# Altium project UF_Servo.PrjPcb (part 6 of 8)

## Sheet EEM_Connectors.SchDoc: EEM
size 420 x 297 mm; EDA_Number: ARTIQ; SPICEModelCacheVGBTAUBO: <root> / <DocumentId>VGBTAUBO</DocumentId> / <CacheFrame Number="0"> / <Model Name="pk14" Kind="CKT"> / <Text>*.INC dhvqfn.s / .SUBCKT pk14 / +    1   2   3   4   5   6   7   8   9  10 / +   11  12  13  14 / +   15  16  17  18  19  20  21  22  23  24 / +   25  26  27  28 / * Pin Resistance / r1 1 1001 9.078E-02 / r2 2 1002 8.829E-02 / r3 3 1003 8.731E-02 / r4 4 1004 8.710E-02 / r5 5 1005 8.731E-02 / r6 6 1006 8.829E-02 / r7 7 1007 9.075E-02 / r8 8 1008 9.072E-02 / r9 9 1009 8.809E-02 / r10 10 1010 8.716E-02 / r11 11 1011 8.706E-02 / r12 12 1012 8.720E-02 / r13 13 1013 8.816E-02 / r14 14 1014 9.068E-02 / * Pin Inductance / l1 1001 15 2.981E-09 / l2 1002 16 2.447E-09 / l3 1003 17 2.304E-09 / l4 1004 18 2.291E-09 / l5 1005 19 2.307E-09 / l6 1006 20 2.449E-09 / l7 1007 21 2.971E-09 / l8 1008 22 2.972E-09 / l9 1009 23 2.425E-09 / l10 1010 24 2.286E-09 / l11 1011 25 2.280E-09 / l12 1012 26 2.286E-09 / l13 1013 27 2.425E-09 / l14 1014 28 2.975E-09 / .ENDS pk14</Text> / </Model> / </CacheFrame> / </root>; CheckedBy: P.Kulik; Author: G.Kasprowicz; CompanyName: WUT ISE; DrawnBy: G.Kasprowicz; Organization: WUT ISE; Address1: PW ISE; Address2: Nowowiejska 15/19 00-665 Warsaw; Address3: gkasprow@gmail.com; Revision: 2; SheetNumber: 10; SheetTotal: 12; ModifiedBy: -; CheckedDate: -; Title2: Connectors; DivGrp: WUT ISE; Designer: G.Kasprowicz; ModifiedDate: -; ProjectName: Sensor Box
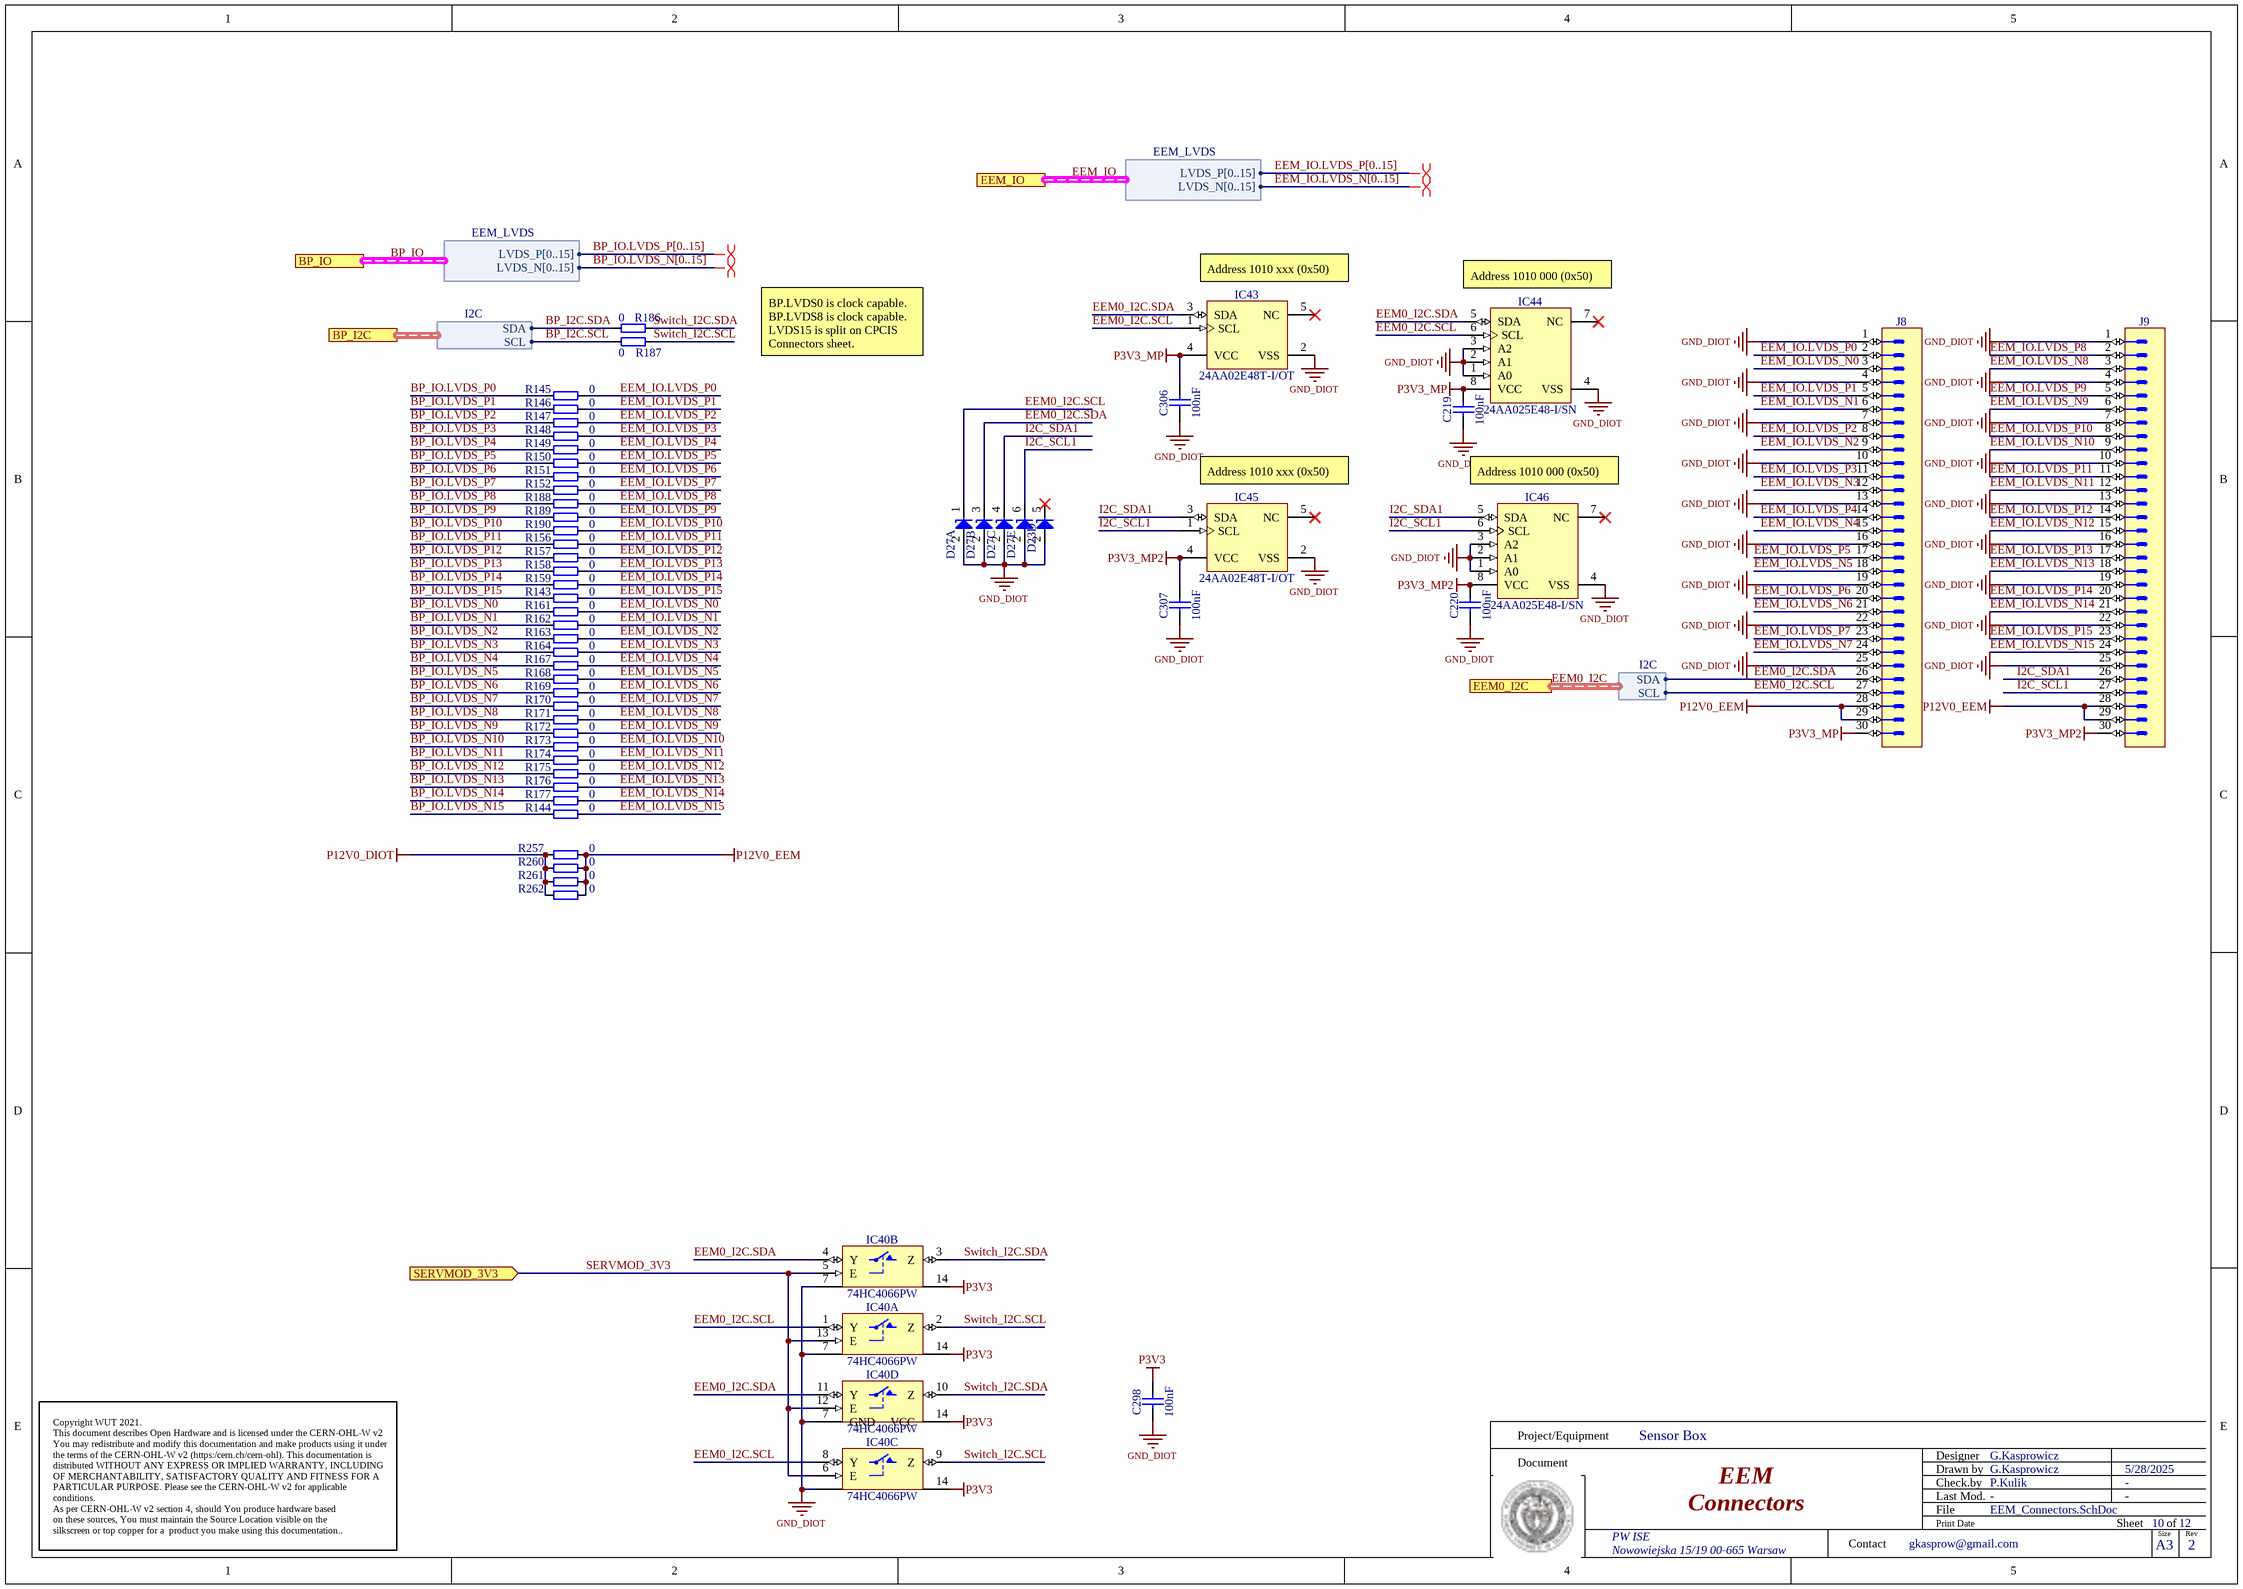
[diagram p9: EEM_Connectors.SchDoc]

### Parts
C219  100nF  [CAPC1005X55N]
C220  100nF  [CAPC1005X55N]
C298  100nF  [CAPC1005X55N]
C306  100nF  [CAPC1005X55N]
C307  100nF  [CAPC1005X55N]
D23  PESD3V3L5UY  [SOT65P210X110-6N]  (value not drawn)  (part D of 5)
D27  PESD3V3L5UY  [SOT65P210X110-6N]  (value not drawn)  (parts A,B,C,E of 5)
IC40  74HC4066PW  [SOP65P640X110-14N]  (parts A,B,C,D of 4)
IC43  24AA02E48T-I/OT  [SOT95P280X145-5N]
IC44  24AA025E48-I/SN  [SOIC127P600X175-8N]
IC45  24AA02E48T-I/OT  [SOT95P280X145-5N]
IC46  24AA025E48-I/SN  [SOIC127P600X175-8N]
J8  (no value)  [3M_N2530-6002RB]
J9  (no value)  [3M_N2530-6002RB]
R143  0  [RESC1005X40N]
R144  0  [RESC1005X40N]
R145  0  [RESC1005X40N]
R146  0  [RESC1005X40N]
R147  0  [RESC1005X40N]
R148  0  [RESC1005X40N]
R149  0  [RESC1005X40N]
R150  0  [RESC1005X40N]
R151  0  [RESC1005X40N]
R152  0  [RESC1005X40N]
R156  0  [RESC1005X40N]
R157  0  [RESC1005X40N]
R158  0  [RESC1005X40N]
R159  0  [RESC1005X40N]
R161  0  [RESC1005X40N]
R162  0  [RESC1005X40N]
R163  0  [RESC1005X40N]
R164  0  [RESC1005X40N]
R167  0  [RESC1005X40N]
R168  0  [RESC1005X40N]
R169  0  [RESC1005X40N]
R170  0  [RESC1005X40N]
R171  0  [RESC1005X40N]
R172  0  [RESC1005X40N]
R173  0  [RESC1005X40N]
R174  0  [RESC1005X40N]
R175  0  [RESC1005X40N]
R176  0  [RESC1005X40N]
R177  0  [RESC1005X40N]
R186  0  [RESC1005X40N]
R187  0  [RESC1005X40N]
R188  0  [RESC1005X40N]
R189  0  [RESC1005X40N]
R190  0  [RESC1005X40N]
R257  0  [RESC1005X40N]
R260  0  [RESC1005X40N]
R261  0  [RESC1005X40N]
R262  0  [RESC1005X40N]

### Ports
BP_I2C (harness I2C), BP_IO (harness EEM_LVDS), EEM0_I2C (harness I2C), EEM_IO (harness EEM_LVDS), SERVMOD_3V3 (in)

### Harnesses
I2C: SDA, SCL
EEM_LVDS: LVDS_P[0..15], LVDS_N[0..15]

### Nets
GND: C219.1 C220.1 C298.1 C306.1 C307.1 D23.2(A) D27.2(A) IC40.7(GND) IC43.2(VSS) IC44.1(A0) IC44.2(A1) IC44.3(A2) IC44.4(VSS) IC45.2(VSS) IC46.1(A0) IC46.2(A1) IC46.3(A2) IC46.4(VSS) J8.1 J8.4 J8.7 J8.10 J8.13 J8.16 J8.19 J8.22 J8.25 J9.1 J9.4 J9.7 J9.10 J9.13 J9.16 J9.19 J9.22 J9.25  [also labelled GND_DIOT]
P3V3: C298.2 IC40.14(VCC)
P3V3_MP: C219.2 C306.2 IC43.4(VCC) IC44.8(VCC) J8.30
P3V3_MP2: C220.2 C307.2 IC45.4(VCC) IC46.8(VCC) J9.30
P12V0_DIOT: R257.1 R260.1 R261.1 R262.1
P12V0_EEM: J8.28 J8.29 J9.28 J9.29 R257.2 R260.2 R261.2 R262.2
BP_I2C.SCL: R187.1 ; port BP_I2C.SCL
BP_I2C.SDA: R186.1 ; port BP_I2C.SDA
BP_IO.LVDS_N0: R161.1
BP_IO.LVDS_N1: R162.1
BP_IO.LVDS_N2: R163.1
BP_IO.LVDS_N3: R164.1
BP_IO.LVDS_N4: R167.1
BP_IO.LVDS_N5: R168.1
BP_IO.LVDS_N6: R169.1
BP_IO.LVDS_N7: R170.1
BP_IO.LVDS_N8: R171.1
BP_IO.LVDS_N9: R172.1
BP_IO.LVDS_N10: R173.1
BP_IO.LVDS_N11: R174.1
BP_IO.LVDS_N12: R175.1
BP_IO.LVDS_N13: R176.1
BP_IO.LVDS_N14: R177.1
BP_IO.LVDS_N15: R144.2
BP_IO.LVDS_P0: R145.1
BP_IO.LVDS_P1: R146.1
BP_IO.LVDS_P2: R147.1
BP_IO.LVDS_P3: R148.1
BP_IO.LVDS_P4: R149.1
BP_IO.LVDS_P5: R150.1
BP_IO.LVDS_P6: R151.1
BP_IO.LVDS_P7: R152.1
BP_IO.LVDS_P8: R188.1
BP_IO.LVDS_P9: R189.1
BP_IO.LVDS_P10: R190.1
BP_IO.LVDS_P11: R156.1
BP_IO.LVDS_P12: R157.1
BP_IO.LVDS_P13: R158.1
BP_IO.LVDS_P14: R159.1
BP_IO.LVDS_P15: R143.2
EEM0_I2C.SCL: D27.1(C) IC40.1(Y) IC40.8(Y) IC43.1(SCL) IC44.6(SCL) J8.27 ; port EEM0_I2C.SCL
EEM0_I2C.SDA: D27.3(C) IC40.4(Y) IC40.11(Y) IC43.3(SDA) IC44.5(SDA) J8.26 ; port EEM0_I2C.SDA
EEM_IO.LVDS_N0: J8.3 R161.2
EEM_IO.LVDS_N1: J8.6 R162.2
EEM_IO.LVDS_N2: J8.9 R163.2
EEM_IO.LVDS_N3: J8.12 R164.2
EEM_IO.LVDS_N4: J8.15 R167.2
EEM_IO.LVDS_N5: J8.18 R168.2
EEM_IO.LVDS_N6: J8.21 R169.2
EEM_IO.LVDS_N7: J8.24 R170.2
EEM_IO.LVDS_N8: J9.3 R171.2
EEM_IO.LVDS_N9: J9.6 R172.2
EEM_IO.LVDS_N10: J9.9 R173.2
EEM_IO.LVDS_N11: J9.12 R174.2
EEM_IO.LVDS_N12: J9.15 R175.2
EEM_IO.LVDS_N13: J9.18 R176.2
EEM_IO.LVDS_N14: J9.21 R177.2
EEM_IO.LVDS_N15: J9.24 R144.1
EEM_IO.LVDS_P0: J8.2 R145.2
EEM_IO.LVDS_P1: J8.5 R146.2
EEM_IO.LVDS_P2: J8.8 R147.2
EEM_IO.LVDS_P3: J8.11 R148.2
EEM_IO.LVDS_P4: J8.14 R149.2
EEM_IO.LVDS_P5: J8.17 R150.2
EEM_IO.LVDS_P6: J8.20 R151.2
EEM_IO.LVDS_P7: J8.23 R152.2
EEM_IO.LVDS_P8: J9.2 R188.2
EEM_IO.LVDS_P9: J9.5 R189.2
EEM_IO.LVDS_P10: J9.8 R190.2
EEM_IO.LVDS_P11: J9.11 R156.2
EEM_IO.LVDS_P12: J9.14 R157.2
EEM_IO.LVDS_P13: J9.17 R158.2
EEM_IO.LVDS_P14: J9.20 R159.2
EEM_IO.LVDS_P15: J9.23 R143.1
I2C_SCL1: D27.6(C) IC45.1(SCL) IC46.6(SCL) J9.27
I2C_SDA1: D27.4(C) IC45.3(SDA) IC46.5(SDA) J9.26
SERVMOD_3V3: IC40.5(E) IC40.6(E) IC40.12(E) IC40.13(E) ; port SERVMOD_3V3
Switch_I2C.SCL: IC40.2(Z) IC40.9(Z) R187.2
Switch_I2C.SDA: IC40.3(Z) IC40.10(Z) R186.2

Not connected (* = marked no-connect by the designer): D23 5(C)*; IC43 5(NC)*; IC44 7(NC)*; IC45 5(NC)*; IC46 7(NC)*

### Buses and harness runs
bus BP_IO.LVDS_N[0..15]
bus BP_IO.LVDS_P[0..15]
bus EEM_IO.LVDS_N[0..15]
bus EEM_IO.LVDS_P[0..15]
harness BP_IO = port BP_IO
harness EEM0_I2C = port EEM0_I2C
harness EEM_IO = port EEM_IO

### Layout directives
differential pair; net class D100: (no net found under the mark)

### Notes on the sheet
- (near IC43) Address 1010 xxx (0x50)
- (near IC44) Address 1010 000 (0x50)
- BP.LVDS0 is clock capable.
  BP.LVDS8 is clock capable.
  LVDS15 is split on CPCIS Connectors sheet.
- Address 1010 xxx (0x50)
- Address 1010 000 (0x50)
- Project/Equipment
- Document
- Designer
- Drawn by
- Check.by
- Contact
- File
- Last Mod.
- Print Date
- Sheet
- Size
- A3
- of
- Rev
- Copyright WUT 2021.
  This document describes Open Hardware and is licensed under the CERN-OHL-W v2
  You may redistribute and modify this documentation and make products using it under the terms of the CERN-OHL-W v2 (https:/cern.ch/cern-ohl). This documentation is distributed WITHOUT ANY EXPRESS OR IMPLIED WARRANTY, INCLUDING OF MERCHANTABILITY, SATISFACTORY QUALITY AND FITNESS FOR A PARTICULAR PURPOSE. Please see the CERN-OHL-W v2 for applicable conditions.
  As per CERN-OHL-W v2 section 4, should You produce hardware based
  on these sources, You must maintain the Source Location visible on the
  silkscreen or top copper for a  product you make using this documentation..

### Library data of the parts
C219 C220 C298 C306 C307 = CC0402_100NF_50V_10%_X7R: as C184-C188 on sheet IO_Expander; Part Number: CC0402_100NF_50V_10%_X7R; Component Kind: Standard; Component Type: Standard; Pin Count: 2; Value: 100nF; Status: None; Manufacturer Part Number: CC0402_100NF_50V_10%_X7R; Case: 0402; Mounted: Yes; Socket: No; SMD: Yes; Sense: No; HelpURL: \\cern.ch\dfs\Applications\Altium\Datasheets\CC0402_MURATA_GRM155R71H104KE14D.pdf; Author: CERN DEM MR; CreateDate: 30.06.2017; LatestRevisionDate: 30.06.2017; Manufacturer1 Example: MURATA; Manufacturer1 ComponentHeight: 0.55mm
D23 D27 = PESD3V3L5UY: Fivefold ESD Protection Diode Arrays; Part Description: Fivefold ESD Protection Diode Arrays (30kV); Manufacturer: NEXPERIA; Voltage: 3.3V; Power: 200W; PressFit: No; Bonding: No; Part Number: PESD3V3L5UY; Component Kind: Standard; Component Type: Standard; Device: PESD3V3L5UY; PackageDescription: SOT363, SC-88, 0.65mm Pitch; 6 Pin, 1.25mm W X 2.00mm L X 1.10mm H body, IPC Medium Density; Manufacturer Part Number: PESD3V3L5UY; Pin Count: 6; Case: SOT363; Mounted: Yes; Socket: No; SMD: Yes; Sense: No; ComponentHeight: 1.1mm; HelpURL: \\cern.ch\dfs\Applications\Altium\Datasheets\PESD3V3L5UY.pdf; Author: CERN DEM WB; CreateDate: 05.07.2021; LatestRevisionDate: 05.07.2021
IC40 = 74HC4066PW: Part Description: Quad Single-Pole Single-Throw Analog Switch; Manufacturer: NXP SEMICONDUCTORS; PressFit: No; Bonding: No; Table: Standard Logic; Part Number: 74HC4066PW; Component Kind: Standard; Component Type: Standard; Device: 74HC4066PW; PackageDescription: SOP, 14-Leads, Body 4.4x5mm (max), Pitch 0.65mm, IPC Medium Density; Manufacturer Part Number: 74HC4066PW; Pin Count: 14; Case: TSSOP14; Mounted: Yes; Socket: No; SMD: Yes; ComponentHeight: 1.1mm; Author: CERN DEM JLC; HelpURL: \\cern.ch\dfs\Applications\Altium\Datasheets\74HC4066PW.pdf; CreateDate: 2014-11-19; LatestRevisionDate: 2014-11-19
IC43 IC45 = 24AA02E48T-I/OT: 1.7V-5.5V, 2K I2C Serial EEPROM With EUI-48 Node Identity; Manufacturer: MICROCHIP TECHNOLOGY; PressFit: No; Bonding: No; Part Number: 24AA02E48T-I/OT; Component Kind: Standard; Component Type: Standard; Device: 24AA02E48T-I/OT; PackageDescription: SOT, 0.95mm pitch; 5 pin, 1.60mm W X 2.90mm L X 1.45mm H body, IPC Medium Density; Part Description: 1.7V-5.5V, 2K I2C Serial EEPROM with EUI-48 Node Identity; Manufacturer Part Number: 24AA02E48T-I/OT; Pin Count: 5; Case: SOT23-5; Mounted: Yes; Socket: No; SMD: Yes; Sense: No; ComponentHeight: 1.45mm; HelpURL: \\cern.ch\dfs\Applications\Altium\Datasheets\24AA02E48T-I-OT.pdf; Author: CERN DEM MR; CreateDate: 31.03.2016; LatestRevisionDate: 31.03.2016
IC44 IC46 = 24AA025E48-I/SN: 1.7V-5.5V, 2K I2C™ Serial EEPROMs with EUI-48™ Node Identity; Manufacturer: MICROCHIP TECHNOLOGY; PressFit: No; Bonding: No; Part Number: 24AA025E48-I/SN; Component Kind: Standard; Component Type: Standard; Device: 24AA025E48-I/SN; PackageDescription: SOIC 8, Pitch 1.27mm - Body 4x5mm, IPC Medium Density; Part Description: 1.7V-5.5V, 2K I2C™ Serial EEPROMs with EUI-48™ Node Identity; Manufacturer Part Number: 24AA025E48-I/SN; Pin Count: 8; Case: SOIC8; Mounted: Yes; Socket: No; SMD: Yes; Sense: No; ComponentHeight: 1.75mm; HelpURL: \\cern.ch\dfs\Applications\Altium\Datasheets\24AA025E48-I-SN.pdf; Author: CERN DEM MR; CreateDate: 19.07.2016; LatestRevisionDate: 19.07.2016
J8 J9 = 3M_N2530-6002RB: Connector 30 Male; Part Description: 30 Contacts - Straight .100'' x .100'' Low Profile Four-Wall Header, 2500 Series; Manufacturer: 3M; PressFit: No; Part Number: 3M_N2530-6002RB; Component Kind: Standard; Component Type: Standard; Pin Count: 30; Family: Header 30; Mounted: Yes; Socket: No; SMD: No; Sense: No; Status: None; Manufacturer Part Number: N2530-6002RB; ComponentHeight: 10.03mm; HelpURL: \\cern.ch\dfs\Applications\Altium\Datasheets\3M_N2530-6002RB.pdf; Author: CERN DEM JLC; CreateDate: 11.02.2009; LatestRevisionDate: 11.08.2009
R143-R152 R156-R159 R161-R164 R167-R177 R186-R190 R257 R260-R262 = R0402_0R_JUMPER: Resistor; Part Description: 1A (0.05R Max DC Resistance) Zero Ohm Jumper; Manufacturer: GENERIC; Manufacturer1 Part Number: 232270591001L; PressFit: No; Part Number: R0402_0R_JUMPER; Component Kind: Standard; Component Type: Standard; Pin Count: 2; Value: 0; Status: Not Recommended; Manufacturer Part Number: R0402_0R_JUMPER; Case: 0402; Mounted: Yes; Sense: No; Socket: No; SMD: Yes; Manufacturer1 Example: YAGEO PHYCOMP; Manufacturer1 ComponentHeight: 0.4mm; HelpURL: \\cern.ch\dfs\Applications\Altium\Datasheets\R0402_Phycomp_RC0402.pdf; Author: CERN DEM JLC; CreateDate: 03.12.2007; LatestRevisionDate: 17.10.2012

## Sheet Isolated_Power_supply.SchDoc: Power Supply
size A2; Author: M.Beldyga; CompanyName: WUT ISE; DrawnBy: M.Beldyga; Organization: WUT ISE; Address1: PW ISE; Address2: Nowowiejska 15/19 00-665 Warsaw; Address3: micbeldyga@gmail.com; SheetNumber: 11; SheetTotal: 12; ModifiedBy: -; CheckedDate: -; Title2: LLC + LDO; DivGrp: WUT ISE; Designer: M.Beldyga; ModifiedDate: -; ProjectName: Sensor Box
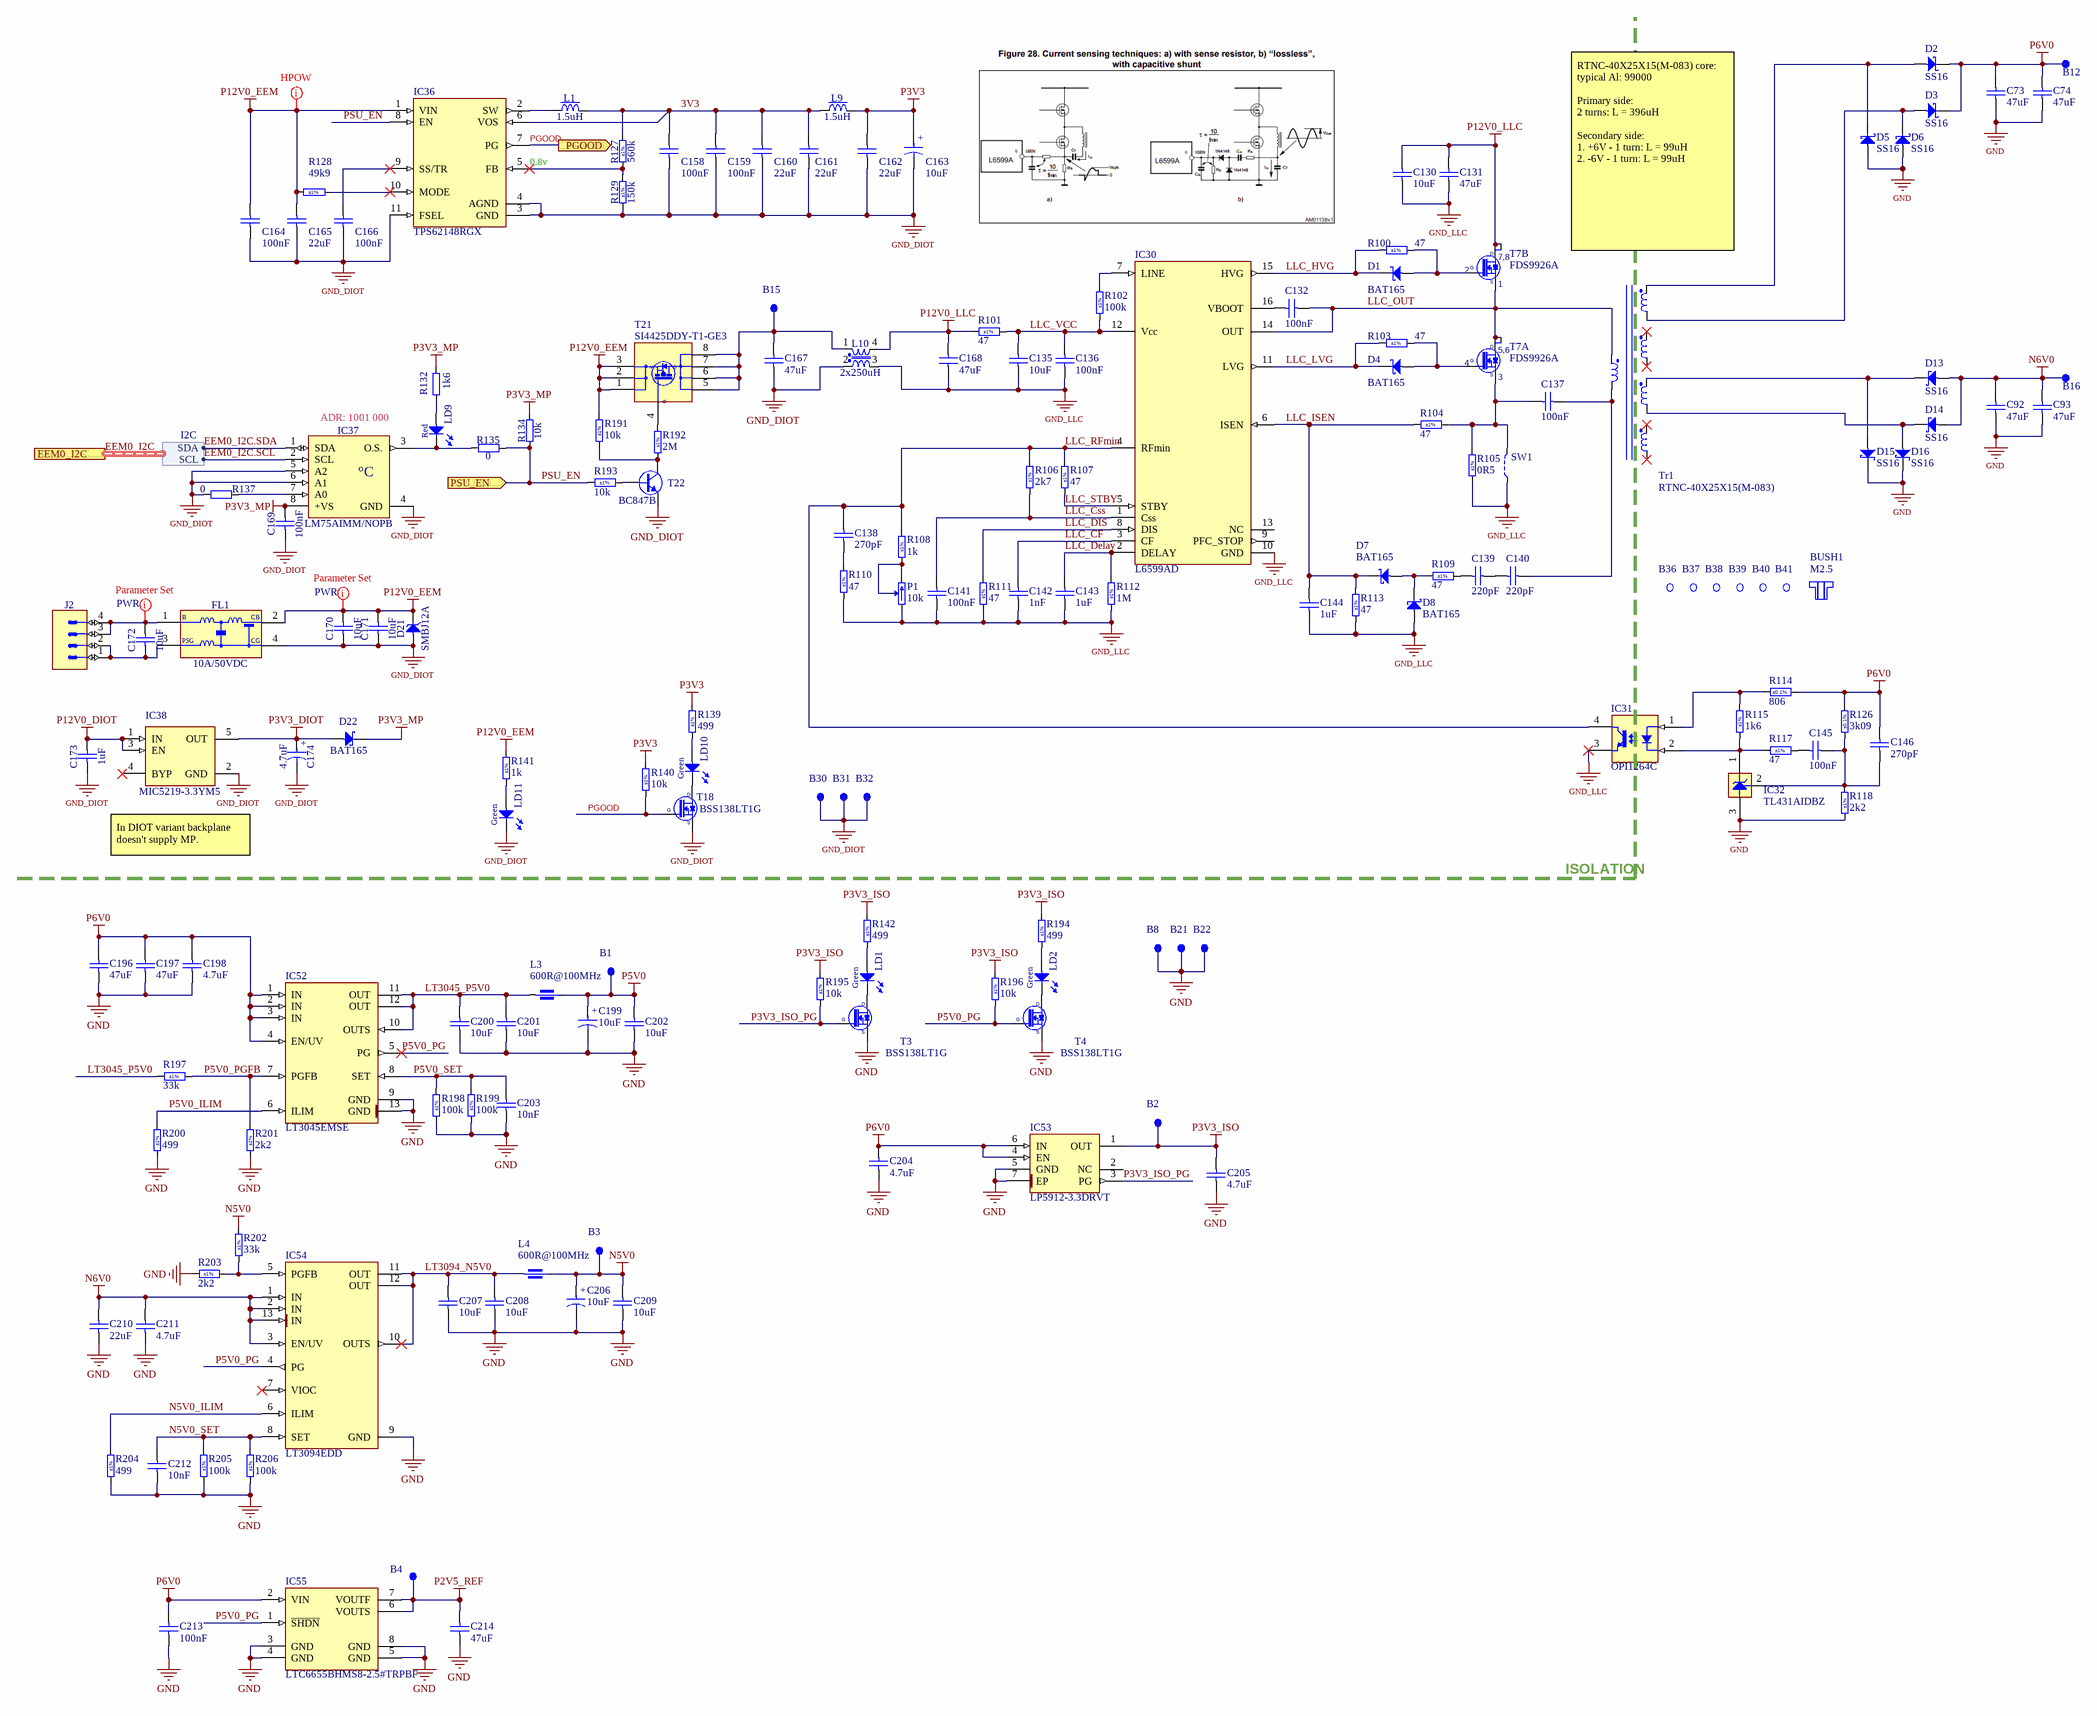
[diagram p10: Isolated_Power_supply.SchDoc]

### Parts
(Parts that share a designator on the sheet are numbered #1, #2 ... from top to bottom, then left to right.)
B1  SMD Pad  [C100]  (value not drawn)  (no BOM)
B2  SMD Pad  [C100]  (value not drawn)  (no BOM)
B3  SMD Pad  [C100]  (value not drawn)  (no BOM)
B4  SMD Pad  [C100]  (value not drawn)  (no BOM)
B8  SMD Pad  [C100]  (value not drawn)  (no BOM)
B12  SMD Pad  [C100]  (value not drawn)  (no BOM)
B15  SMD Pad  [C100]  (value not drawn)  (no BOM)
B16  SMD Pad  [C100]  (value not drawn)  (no BOM)
B21  SMD Pad  [C100]  (value not drawn)  (no BOM)
B22  SMD Pad  [C100]  (value not drawn)  (no BOM)
B30  SMD Pad  [C100]  (value not drawn)  (no BOM)
B31  SMD Pad  [C100]  (value not drawn)  (no BOM)
B32  SMD Pad  [C100]  (value not drawn)  (no BOM)
B36  Non Plated Hole  [MTG300]  (value not drawn)  (no BOM)
B37  Non Plated Hole  [MTG300]  (value not drawn)  (no BOM)
B38  Non Plated Hole  [MTG300]  (value not drawn)  (no BOM)
B39  Non Plated Hole  [MTG300]  (value not drawn)  (no BOM)
B40  Non Plated Hole  [MTG300]  (value not drawn)  (no BOM)
B41  Non Plated Hole  [MTG300]  (value not drawn)  (no BOM)
BUSH1  M2.5  [WURTH_9774010151]
C73  47uF  [CAPC3216X180N]
C74  47uF  [CAPC3216X180N]
C92  47uF  [CAPC3216X180N]
C93  47uF  [CAPC3216X180N]
C130  10uF  [CAPC3216X180N]
C131  47uF  [CAPC3216X180N]
C132  100nF  [CAPC1005X55N]
C135  10uF  [CAPC3216X180N]
C136  100nF  [CAPC1005X55N]
C137  100nF  [CAPC4532X250N]
C138  270pF  [CAPC1608X87N]
C139  220pF  [CAPC3225X200N]
C140  220pF  [CAPC3225X200N]
C141  100nF  [CAPC1005X55N]
C142  1nF  [CAPC1608X90N]
C143  1uF  [CAPC1608X87N]
C144  1uF  [CAPC1608X87N]
C145  100nF  [CAPC1005X55N]
C146  270pF  [CAPC1608X87N]
C158  100nF  [CAPC1005X55N]
C159  100nF  [CAPC1005X55N]
C160  22uF  [CAPC2012X135N]
C161  22uF  [CAPC2012X135N]
C162  22uF  [CAPC2012X135N]
C163  10uF  [CAPMP3216X180N]
C164  100nF  [CAPC1005X55N]
C165  22uF  [CAPC2012X135N]
C166  100nF  [CAPC1005X55N]
C167  47uF  [CAPC3216X180N]
C168  47uF  [CAPC3216X180N]
C169  100nF  [CAPC1005X55N]
C170  10uF  [CAPC2012X95N]
C171  10uF  [CAPC2012X95N]
C172  10uF  [CAPC2012X95N]
C173  1uF  [CAPC1608X87N]
C174  4.7uF  [CAPMP3216X180N]
C196  47uF  [CAPC3216X180N]
C197  47uF  [CAPC3216X180N]
C198  4.7uF  [CAPC1608X90N]
C199  10uF  [CAPMP3216X180N]
C200  10uF  [CAPC2012X95N]
C201  10uF  [CAPC2012X95N]
C202  10uF  [CAPC2012X95N]
C203  10nF  [CAPC1005X55N]
C204  4.7uF  [CAPC1608X90N]
C205  4.7uF  [CAPC1608X90N]
C206  10uF  [CAPMP3216X180N]
C207  10uF  [CAPC2012X95N]
C208  10uF  [CAPC2012X95N]
C209  10uF  [CAPC2012X95N]
C210  22uF  [CAPC2012X135N]
C211  4.7uF  [CAPC1608X90N]
C212  10nF  [CAPC1005X55N]
C213  100nF  [CAPC1005X55N]
C214  47uF  [CAPC2012X140N]
D1  BAT165  [SOD2512X110N]
D2  SS16  [DIOM5127X229N]
D3  SS16  [DIOM5127X229N]
D4  BAT165  [SOD2512X110N]
D5#2  SS16  [DIOM5127X229N]
D6#2  SS16  [DIOM5127X229N]
D7#2  BAT165  [SOD2512X110N]
D8  BAT165  [SOD2512X110N]
D13  SS16  [DIOM5127X229N]
D14  SS16  [DIOM5127X229N]
D15  SS16  [DIOM5127X229N]
D16  SS16  [DIOM5127X229N]
D21  SMBJ12A  [DIOM5336X265N]
D22  BAT165  [SOD2512X110N]
FL1  10A/50VDC  [FIL_MURATA_BNX02]
IC30  L6599AD  [SOP127P600X175-16N]
IC31  OPI1264C  [OPI1264C]
IC32  TL431AIDBZ  [SOT95P237X112-3N]
IC36  TPS62148RGX  [TEXAS_RGX0011A]
IC37  LM75AIMM/NOPB  [SOP65P490X109-8N]
IC38  MIC5219-3.3YM5  [SOT95P280X145-5N]
IC52  LT3045EMSE  [SOP65P490X110-13N-R175X294]
IC53  LP5912-3.3DRVT  [SON65P200X200X80-7N-R110X170]
IC54  LT3094EDD  [SON45P300X300X80-13N-R175X248]
IC55  LTC6655BHMS8-2.5#TRPBF  [SOP65P490X110-8N]
J2  Mini-Fit Jr.™  [MOLEX_39-30-0040]  (value not drawn)
L1  1.5uH  [IND_WURTH_WE-LHMI_7050]
L3  600R@100MHz  [INDC1608X95N]
L4  600R@100MHz  [INDC1608X95N]
L9  1.5uH  [IND_WURTH_WE-LHMI_7050]
L10  2x250uH  [IND_WURTH_WE-SL2]
LD1  Green  [LED_KINGBRIGHT_KP-1608CGCK]
LD2  Green  [LED_KINGBRIGHT_KP-1608CGCK]
LD9  Red  [LED_AVAGO_HSMC-C110]
LD10  Green  [LED_KINGBRIGHT_KP-1608CGCK]
LD11  Green  [LED_AVAGO_HSME-C110]
P1  10k  [TRIM_BOURNS_3314G-1]
R100  47  Tolerance: ±1%  [RESC1608X55N]
R101  47  Tolerance: ±1%  [RESC1608X55N]
R102  100k  Tolerance: ±1%  [RESC1005X40N]
R103  47  Tolerance: ±1%  [RESC1608X55N]
R104  47  Tolerance: ±1%  [RESC1608X55N]
R105  0R5  Tolerance: ±1%  [RESC6532X80N]
R106  2k7  Tolerance: ±1%  [RESC1608X55N]
R107  47  Tolerance: ±1%  [RESC1608X55N]
R108  1k  Tolerance: ±1%  [RESC1005X40N]
R109  47  Tolerance: ±1%  [RESC1608X55N]
R110  47  Tolerance: ±1%  [RESC1608X55N]
R111  47  Tolerance: ±1%  [RESC1608X55N]
R112  1M  Tolerance: ±1%  [RESC1608X55N]
R113  47  Tolerance: ±1%  [RESC1608X55N]
R114  806  Tolerance: ±0.1%  [RESC1608X55N]
R115  1k6  Tolerance: ±1%  [RESC1608X55N]
R117  47  Tolerance: ±1%  [RESC1608X55N]
R118  2k2  Tolerance: ±1%  [RESC1005X40N]
R126  3k09  Tolerance: ±0.1%  [RESC1608X55N]
R127  560k  Tolerance: ±1%  [RESC1608X55N]
R128  49k9  Tolerance: ±1%  [RESC1608X55N]
R129  150k  Tolerance: ±1%  [RESC1608X55N]
R132#2  1k6  [RESC1005X40N]
R134#2  10k  [RESC1608X55N]
R135#2  0  [RESC1005X40N]
R137#2  0  [RESC1005X40N]
R139#2  499  Tolerance: ±1%  [RESC1005X40N]
R140#2  10k  Tolerance: ±1%  [RESC1005X40N]
R141  1k  Tolerance: ±1%  [RESC1005X40N]
R142  499  Tolerance: ±1%  [RESC1005X40N]
R191  10k  Tolerance: ±1%  [RESC1005X40N]
R192  2M  Tolerance: ±1%  [RESC1005X40N]
R193  10k  Tolerance: ±1%  [RESC1005X40N]
R194  499  Tolerance: ±1%  [RESC1005X40N]
R195  10k  Tolerance: ±1%  [RESC1005X40N]
R196  10k  Tolerance: ±1%  [RESC1005X40N]
R197  33k  Tolerance: ±1%  [RESC1005X40N]
R198  100k  Tolerance: ±1%  [RESC1005X40N]
R199  100k  Tolerance: ±1%  [RESC1005X40N]
R200  499  Tolerance: ±1%  [RESC1005X40N]
R201  2k2  Tolerance: ±1%  [RESC1005X40N]
R202  33k  Tolerance: ±1%  [RESC1005X40N]
R203  2k2  Tolerance: ±1%  [RESC1005X40N]
R204  499  Tolerance: ±1%  [RESC1005X40N]
R205  100k  Tolerance: ±1%  [RESC1005X40N]
R206  100k  Tolerance: ±1%  [RESC1005X40N]
SW1  Switch  [JUMPSMD0805_G50]  (value not drawn)  (no BOM)
T3  BSS138LT1G  [SOT95P240X110-3N]
T4  BSS138LT1G  [SOT95P240X110-3N]
T7  FDS9926A  [SOIC127P600X175-8N]  (parts A,B of 2)
T18  BSS138LT1G  [SOT95P240X110-3N]
T21  SI4425DDY-T1-GE3  [SOIC127P600X175-8N]
T22  BC847B  [SOT95P230X110-3N]
Tr1  RTNC-40X25X15(M-083)  [RTNC-40X25X15(M-083)]

### Ports
EEM0_I2C (harness I2C), PGOOD (out), PSU_EN (in)

### Harnesses
I2C: SDA, SCL

### Nets
GND: B8.1 B21.1 B22.1 B30.1 B31.1 B32.1 C73.2 C74.2 C92.2 C93.2 C158.1 C159.1 C160.1 C161.1 C162.1 C163.2 C164.1 C165.1 C166.1 C167.1 C169.1 C170.1 C171.1 C173.1 C174.2 C196.1 C197.1 C198.1 C199.2 C200.1 C201.1 C202.1 C203.1 C204.1 C205.1 C206.2 C207.1 C208.1 C209.1 C210.1 C211.1 C212.1 C213.1 C214.1 D5#2.2(A) D6#2.2(A) D15.1(C) D16.1(C) D21.2(A) FL1.4(CG) IC32.3(A) IC36.3(GND) IC36.4(AGND) IC36.11(FSEL) IC37.4(GND) IC37.5(A2) IC37.6(A1) IC38.2(GND) IC52.9(GND) IC52.13(GND) IC53.5(GND) IC53.7(EP) IC54.9(GND) IC55.3(GND) IC55.4(GND) IC55.5(GND) IC55.8(GND) L10.2 LD11.1(C) R118.1 R129.1 R137#2.1 R198.1 R199.1 R200.1 R201.1 R203.2 R204.1 R205.1 R206.1 T3.2(S) T4.2(S) T18.2(S) T22.2(E)  [also labelled GND_DIOT]
GND_LLC: C130.2 C131.2 C135.2 C136.1 C141.2 C142.1 C143.1 C144.1 C168.1 D8.2(A) IC30.10(GND) IC31.3(E) L10.3 P1.1(CCW) R105.1 R110.1 R111.1 R112.1 R113.1 SW1.1
N5V0: B3.1 C206.1 C209.2 L4.2 R202.2
N6V0: B16.1 C92.1 C93.1 C210.2 C211.2 D13.2(A) D14.2(A) IC54.1(IN) IC54.2(IN) IC54.3(EN/UV) IC54.13(IN)
P2V5_REF: B4.1 C214.2 IC55.6(VOUTS) IC55.7(VOUTF)
P3V3: C162.2 C163.1 L9.2 R139#2.2 R140#2.2
P3V3_DIOT: C174.1 D22.2(A) IC38.5(OUT)
P3V3_ISO: B2.1 C205.2 IC53.1(OUT) R142.2 R194.2 R195.2 R196.2
P3V3_MP: C169.2 D22.1(C) IC37.8(+VS) R132#2.2 R134#2.2
P5V0: B1.1 C199.1 C202.2 L3.2
P6V0: B12.1 C73.1 C74.1 C146.2 C196.2 C197.2 C198.2 C204.2 C213.2 D2.1(C) D3.1(C) IC52.1(IN) IC52.2(IN) IC52.3(IN) IC52.4(EN/UV) IC53.4(EN) IC53.6(IN) IC55.2(VIN) R114.2 R126.2
P12V0_DIOT: C173.2 IC38.1(IN) IC38.3(EN)
P12V0_EEM: C164.2 C165.2 C170.2 C171.2 D21.1(C) FL1.2(CB) IC36.1(VIN) R128.1 R141.2 R191.1 T21.1(S) T21.2(S) T21.3(S)
P12V0_LLC: C130.1 C131.1 C168.2 L10.4 R101.2 T7.7(D) T7.8(D)
3V3: C158.2 C159.2 C160.2 C161.2 IC36.6(VOS) L1.2 L9.1 R127.2
EEM0_I2C.SCL: IC37.2(SCL) ; port EEM0_I2C.SCL
EEM0_I2C.SDA: IC37.1(SDA) ; port EEM0_I2C.SDA
LLC_CF: C142.2 IC30.3(CF)
LLC_Css: C141.1 IC30.1(Css) R106.1
LLC_Delay: C143.2 IC30.2(DELAY) R112.2
LLC_DIS: IC30.8(DIS) R111.2
LLC_HVG: D1.1(C) IC30.15(HVG) R100.1
LLC_ISEN: C144.2 D7#2.1(C) IC30.6(ISEN) R104.2 R113.2
LLC_LVG: D4.1(C) IC30.11(LVG) R103.1
LLC_OUT: C132.1 IC30.14(OUT) T7.1(S) T7.5(D) T7.6(D) Tr1.1
LLC_RFmin: C138.2 IC30.4(RFmin) IC31.4(C) R106.2 R107.2 R108.2
LLC_STBY: IC30.5(STBY) R107.1
LLC_VCC: C135.1 C136.2 IC30.12(Vcc) R101.1 R102.1
LT3045_P5V0: C200.2 C201.2 IC52.10(OUTS) IC52.11(OUT) IC52.12(OUT) L3.1 R197.2
LT3094_N5V0: C207.2 C208.2 IC54.10(OUTS) IC54.11(OUT) IC54.12(OUT) L4.1
N5V0_ILIM: IC54.6(ILIM) R204.2
N5V0_SET: C212.2 IC54.8(SET) R205.2 R206.2
P3V3_ISO_PG: IC53.3(PG) R195.1 T3.1(G)
P5V0_ILIM: IC52.6(ILIM) R200.2
P5V0_PG: IC52.5(PG) IC54.4(PG) IC55.1(~{SHDN}) R196.1 T4.1(G)
P5V0_PGFB: IC52.7(PGFB) R197.1 R201.2
P5V0_SET: C203.2 IC52.8(SET) R198.2 R199.2
PGOOD: IC36.7(PG) R140#2.1 T18.1(G) ; port PGOOD
PSU_EN: IC36.8(EN) R134#2.1 R135#2.2 R193.2 ; port PSU_EN
NetB15_1: B15.1 C167.2 L10.1 T21.5(D) T21.6(D) T21.7(D) T21.8(D)
NetC132_2: C132.2 IC30.16(VBOOT)
NetC137_1: C137.1 R104.1 R105.2 SW1.2 T7.3(S)
NetC137_2: C137.2 C140.2 Tr1.2
NetC138_1: C138.1 R110.2
NetC139_1: C139.1 R109.1
NetC139_2: C139.2 C140.1
NetC145_1: C145.1 C146.1 IC32.2(Adj) R118.2 R126.1
NetC145_2: C145.2 R117.1
NetC166_2: C166.2 IC36.9(SS/TR)
NetC172_1: C172.1 FL1.3(PSG) J2.1 J2.2
NetC172_2: C172.2 FL1.1(B) J2.3 J2.4
NetD1_2: D1.2(A) R100.2 T7.2(G)
NetD2_2: D2.2(A) D5#2.1(C) Tr1.3
NetD3_2: D3.2(A) D6#2.1(C) Tr1.4
NetD4_2: D4.2(A) R103.2 T7.4(G)
NetD7#2_2: D7#2.2(A) D8.1(C) R109.2
NetD13_1: D13.1(C) D15.2(A) Tr1.7
NetD14_1: D14.1(C) D16.2(A) Tr1.8
NetIC30_7: IC30.7(LINE) R102.2
NetIC31_1: IC31.1(A) R114.1 R115.2
NetIC31_2: IC31.2(C) IC32.1(C) R115.1 R117.2
NetIC36_2: IC36.2(SW) L1.1
NetIC36_5: IC36.5(FB) R127.1 R129.2
NetIC36_10: IC36.10(MODE) R128.2
NetIC37_3: IC37.3(O.S.) LD9.1(C) R135#2.1
NetIC37_7: IC37.7(A0) R137#2.2
NetIC54_5: IC54.5(PGFB) R202.1 R203.1
NetLD1_1: LD1.1(C) T3.3(D)
NetLD1_2: LD1.2(A) R142.1
NetLD2_1: LD2.1(C) T4.3(D)
NetLD2_2: LD2.2(A) R194.1
NetLD9_2: LD9.2(A) R132#2.1
NetLD10_1: LD10.1(C) T18.3(D)
NetLD10_2: LD10.2(A) R139#2.1
NetLD11_2: LD11.2(A) R141.1
NetP1_2: P1.2(W) P1.3(CW) R108.1
NetR191_2: R191.2 R192.1 T22.3(C)
NetR192_2: R192.2 T21.4(S)
NetR193_1: R193.1 T22.1(B)

Not connected (* = marked no-connect by the designer): B36 1; B37 1; B38 1; B39 1; B40 1; B41 1; BUSH1 1; IC30 9(PFC_STOP) 13(NC); IC38 4(BYP)*; IC53 2(NC); IC54 7(VIOC)*; Tr1 5* 6* 9* 10*

### Buses and harness runs
harness EEM0_I2C = port EEM0_I2C

### Layout directives
net class PWR: NetC172_2, P12V0_EEM
net class HPOW: P12V0_EEM

### Notes on the sheet
- (near IC36) 0.8v
- (near Tr1) RTNC-40X25X15(M-083) core:
  typical Al: 99000
  Primary side:
  2 turns: L = 396uH
  Secondary side:
  1. +6V - 1 turn: L = 99uH
  2. -6V - 1 turn: L = 99uH
- (near IC37) ADR: 1001 000
- In DIOT variant backplane doesn't supply MP.
- ISOLATION
- Project/Equipment
- Document
- Designer
- Drawn by
- Check.by
- Last Mod.
- Contact
- File
- Print Date
- Sheet
- Size
- A2
- of
- Rev
- (in symbol CTE3216-18_4.7UF_10V_10%_AVX_TPSA475K010T1400) +
- (in symbol CTE3216-18_10UF_10V_10%_LESR1800) +
- (in symbol CTE3216-18_10UF_16V_20%_AVX_TCJ) +
- (in symbol FDS9926A, part A) 5,6
- (in symbol FDS9926A, part B) 7,8
- (in symbol LM75AIMM/NOPB) °C
- (in symbol Si4425DDY-T1-GE3) G